# EAGLE design Shruti pothole (EAGLE 7.6.0)
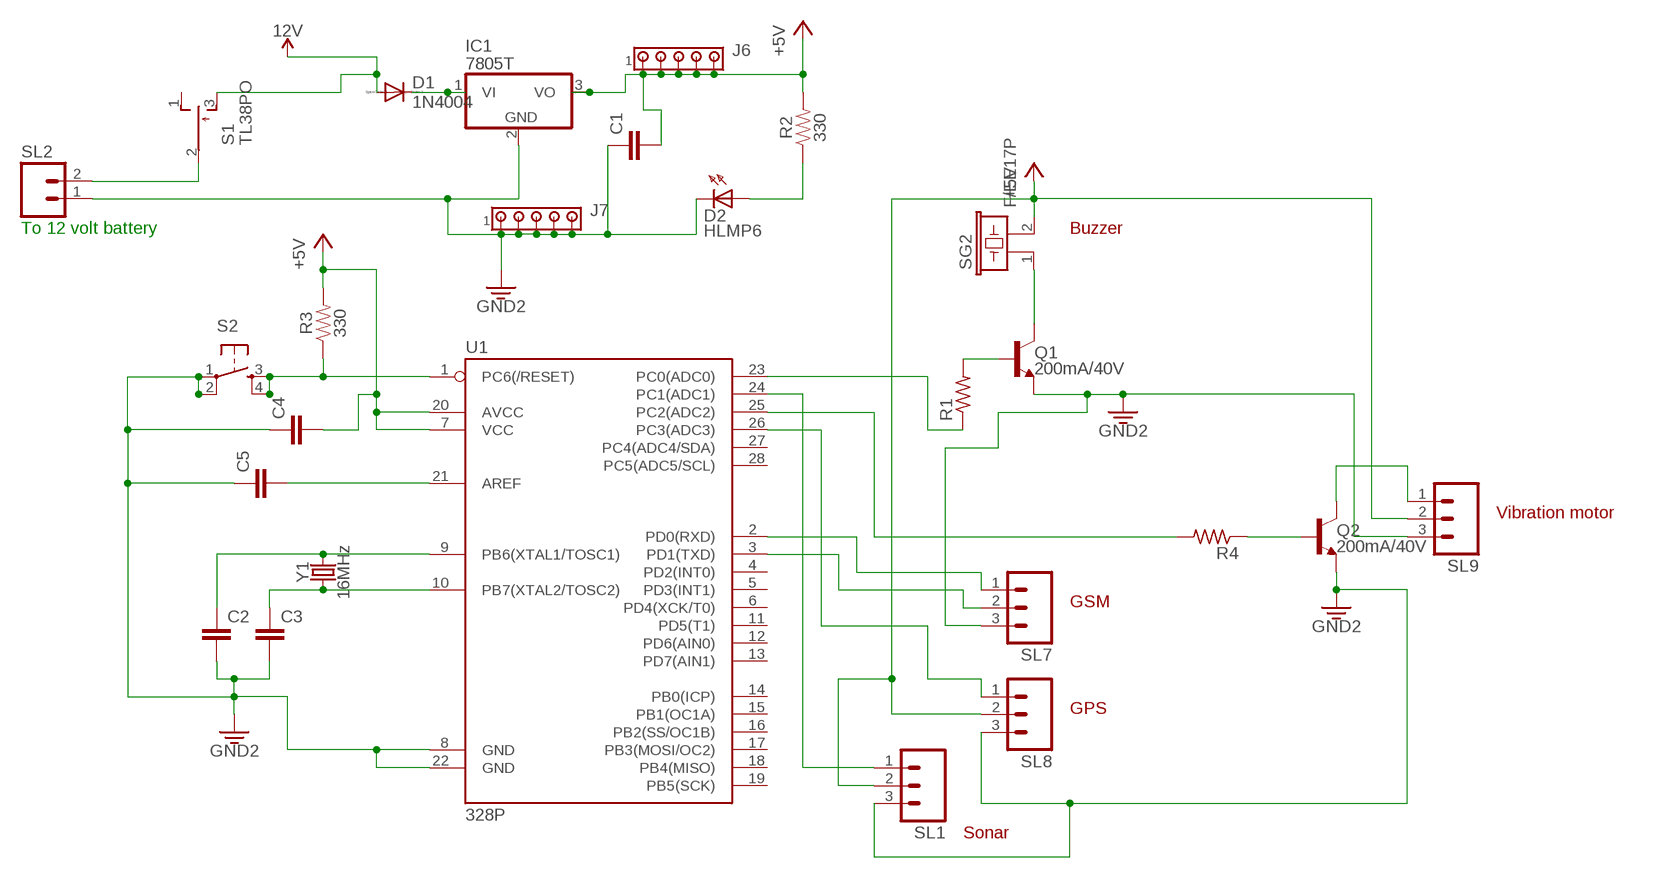
[diagram p0: schematic, sheet 1]

## Parts
C1  C5/2.5  [C5B2.5]
C2  C5/2.5  [C5B2.5]
C3  C5/2.5  [C5B2.5]
C4  C5/2.5  [C5B2.5]
C5  C5/2.5  [C5B2.5]
D1  1N4004  [DO41-10]
D2  HLMP6  [HLMP6]
IC1  7805T  [TO220H]
J6  MTA05-100  [10X05MTA]
J7  MTA05-100  [10X05MTA]
Q1  200mA/40V  TRANS_NPN-2N3904  [TO-92]
Q2  200mA/40V  TRANS_NPN-2N3904  [TO-92]
R1  R-US_0204/7  [0204/7]
R2  330  330OHM-HORIZ-1/10W-5%  [AXIAL-0.3]
R3  330  330OHM-HORIZ-1/10W-5%  [AXIAL-0.3]
R4  R-US_0204/7  [0204/7]
S1  TL38PO  [TL3XPO]
S2  TAC_SWITCHPTH  [TACTILE-PTH]
SG2  F/EE17P  [F/EE17P]
SL1  MA03  [03P]
SL2  MA02  [02PA]
SL7  MA03  [03P]
SL8  MA03  [03P]
SL9  MA03  [03P]
U1  328P  ATMEGA328P_PDIP  [DIP28]
Y1  16MHz  CRYSTAL-16MHZPTH-HC49US  [HC49US]

## Nets
3.3V: C1.1 C2.2 C3.2 C4.1 C5.1 D2.K IC1.2(GND) J7.1 J7.2 J7.3 J7.4 J7.5 Q1.1(E) Q2.1(E) S2.1 S2.2 SL1.3 SL2.1 SL7.3 SL8.3 SL9.3 U1.8(GND) U1.22(GND) ; supply symbol labelled GND2
12V: D1.A S1.3(S)
+5V: C1.2 C4.2 IC1.3(VO) J6.1 J6.2 J6.3 J6.4 J6.5 R2.P$2 R3.P$2 SG2.2 SL1.2 SL8.2 SL9.2 U1.7(VCC) U1.20(AVCC)
N$1: Q1.3(C) SG2.1
N$2: SL7.1 U1.2(PD0(RXD))
N$3: Q1.2(B) R1.2
N$4: Q2.2(B) R4.1
N$5: SL7.2 U1.3(PD1(TXD))
N$6: R1.1 U1.23(PC0(ADC0))
N$7: D2.A R2.P$1
N$8: C3.1 U1.10(PB7(XTAL2/TOSC2)) Y1.1
N$9: SL1.1 U1.24(PC1(ADC1))
N$10: R3.P$1 S2.3 S2.4 U1.1(PC6(/RESET))
N$11: R4.2 U1.25(PC2(ADC2))
N$12: C5.2 U1.21(AREF)
N$13: Q2.3(C) SL9.1
N$14: S1.2(P) SL2.2
N$15: SL8.1 U1.26(PC3(ADC3))
N$16: D1.C IC1.1(VI)
N$18: C2.1 U1.9(PB6(XTAL1/TOSC1)) Y1.2
Unconnected: S1.1(O) U1.4(PD2(INT0)) U1.5(PD3(INT1)) U1.6(PD4(XCK/T0)) U1.11(PD5(T1)) U1.12(PD6(AIN0)) U1.13(PD7(AIN1)) U1.14(PB0(ICP)) U1.15(PB1(OC1A)) U1.16(PB2(SS/OC1B)) U1.17(PB3(MOSI/OC2)) U1.18(PB4(MISO)) U1.19(PB5(SCK)) U1.27(PC4(ADC4/SDA)) U1.28(PC5(ADC5/SCL))

## Notes on the sheet
- To 12 volt battery | Buzzer
- Vibration motor
- GSM
- GPS
- Sonar

## Library data of the parts
C1-C5 = capacitor-wima:C: CAPACITOR naming: grid - package width
D1 = diode:1N4004: DIODE general purpose rectifier, 1 A
D2 = display-hp:HLMP6: LED 2mm horizontal; MF: AGILENT TECHNOLOGIES; MPN: HLMP-6500; OC_FARNELL: 1652490; OC_NEWARK: 40K0088
IC1 = linear:78*: Positive VOLTAGE REGULATOR Source: http://cache.national.com/ds/LM/LM78L05.pdf http://www.fairchildsemi.com/ds/LM/LM7805.pdf
J6 J7 = con-amp:MTA05-100: AMP connector
Q1 Q2 = SparkFun-DiscreteSemi:TRANS_NPN: NPN transistor Current controlled devices typically used to amplify current or used as a switch. BC547 - COM-08928 <http://www.sparkfun.com/products/8928> (TO-92 45V 100mA) (1.Collector 2.Base 3.Emitter) 2N3904 - COM-00521 <http://www.sparkfun.com/products/521> (TO-92 40V 200mA) (1.Emitter 2.Base 3.Collector) P2N2222A - COM-12852 <http://www.sparkfun.com/products/12852> (TO-92 40V 600mA) (1.Collector 2.Base 3.Emitter); PROD_ID: TRANS-08447
R1 R4 = resistor:R-US_: RESISTOR, American symbol
R2 R3 = SparkFun-Resistors:330OHM: 330Ω resistor A resistor is a passive two-terminal electrical component that implements electrical resistance as a circuit element. Resistors act to reduce current flow, and, at the same time, act to lower voltage levels within circuits. - Wikipedia; PROD_ID: RES-8371
S1 = switch:TL38PO: TINY SWITCH ON OFF MOM Source: http://www2.produktinfo.conrad.com/datenblaetter/700000-724999/705152-da-01-de-Subminiaturschalter_TL_36YO.pdf
S2 = SparkFun-Retired:TAC_SWITCH: Momentary Switch Button commonly used for reset or general input. Spark Fun Electronics SKU : COM-00097 SMT- SWCH-08247
SG2 = buzzer:F/EE17P: BUZZER Source: Buerklin; OC_FARNELL: unknown; OC_NEWARK: unknown
SL1 SL7-SL9 = con-amp-quick:MA03: AMP QUICK CONNECTOR; OC_FARNELL: unknown; OC_NEWARK: unknown
SL2 = con-amp-quick:MA02: AMP QUICK CONNECTOR; OC_FARNELL: unknown; OC_NEWARK: unknown
U1 = SparkFun-IC-Microcontroller:ATMEGA328P_PDIP: Atmel 328P Through hole ATMEGA328P uC used in the Arduino 32kb flash, 1k EEPROM, 2k SRAM Datasheet <http://www.sparkfun.com/datasheets/Components/SMD/ATMega328.pdf> SparkFun Products Storefront component: AVR 28 Pin 20MHz 32K 6A/D - ATMega328P <https://www.sparkfun.com/products/9061> (COM-09061) SparkFun Simon Says - Through-Hole Soldering Kit <https://www.sparkfun.com/products/10547> (KIT-10547) SparkFun Learn to Solder - Simon Says <https://www.sparkfun.com/products/13708> (KIT-13708) SparkFun BigTime Watch Kit <https://www.sparkfun.com/products/11734> (KIT-11734) SparkFun ClockIt <https://www.sparkfun.com/products/10930> (KIT-10930) SparkFun Serial Enabled LCD Kit <https://www.sparkfun.com/products/10097> (LCD-10097) SparkFun Simon Tilts - Through Hole Soldering Kit <https://www.sparkfun.com/products/12634> (KIT-12634) SparkFun Frequency Counter Kit <https://www.sparkfun.com/products/10140> (KIT-10140) FabFM Radio Kit <https://www.sparkfun.com/products/11043> (KIT-11043) SparkFun Binary Blaster Kit <https://www.sparkfun.com/products/12037> (KIT-12037) SparkFun Metro-Gnome <https://www.sparkfun.com/products/9236> (KIT-09236) ATmega328 with Arduino Optiboot (Uno) <https://www.sparkfun.com/products/10524> (DEV-10524); PROD_ID: IC-09136
Y1 = SparkFun-Clocks:CRYSTAL-16MHZ: 16MHz Crystal Digikey Example <http://www.digikey.com/product-search/en?keywords=535-9122-1-ND> Frequency: 16MHz Frequency Stability: ±50ppm Frequency Tolerance: ±20ppm Load Capacitance: 18pF SparkFun Products: Pro Micro -5V/16MHz <https://www.sparkfun.com/products/12640> SparkFun Serial Enabled LCD Kit <https://www.sparkfun.com/products/10097>; PROD_ID: XTAL-08181; SF_ID: COM-00536

## Board
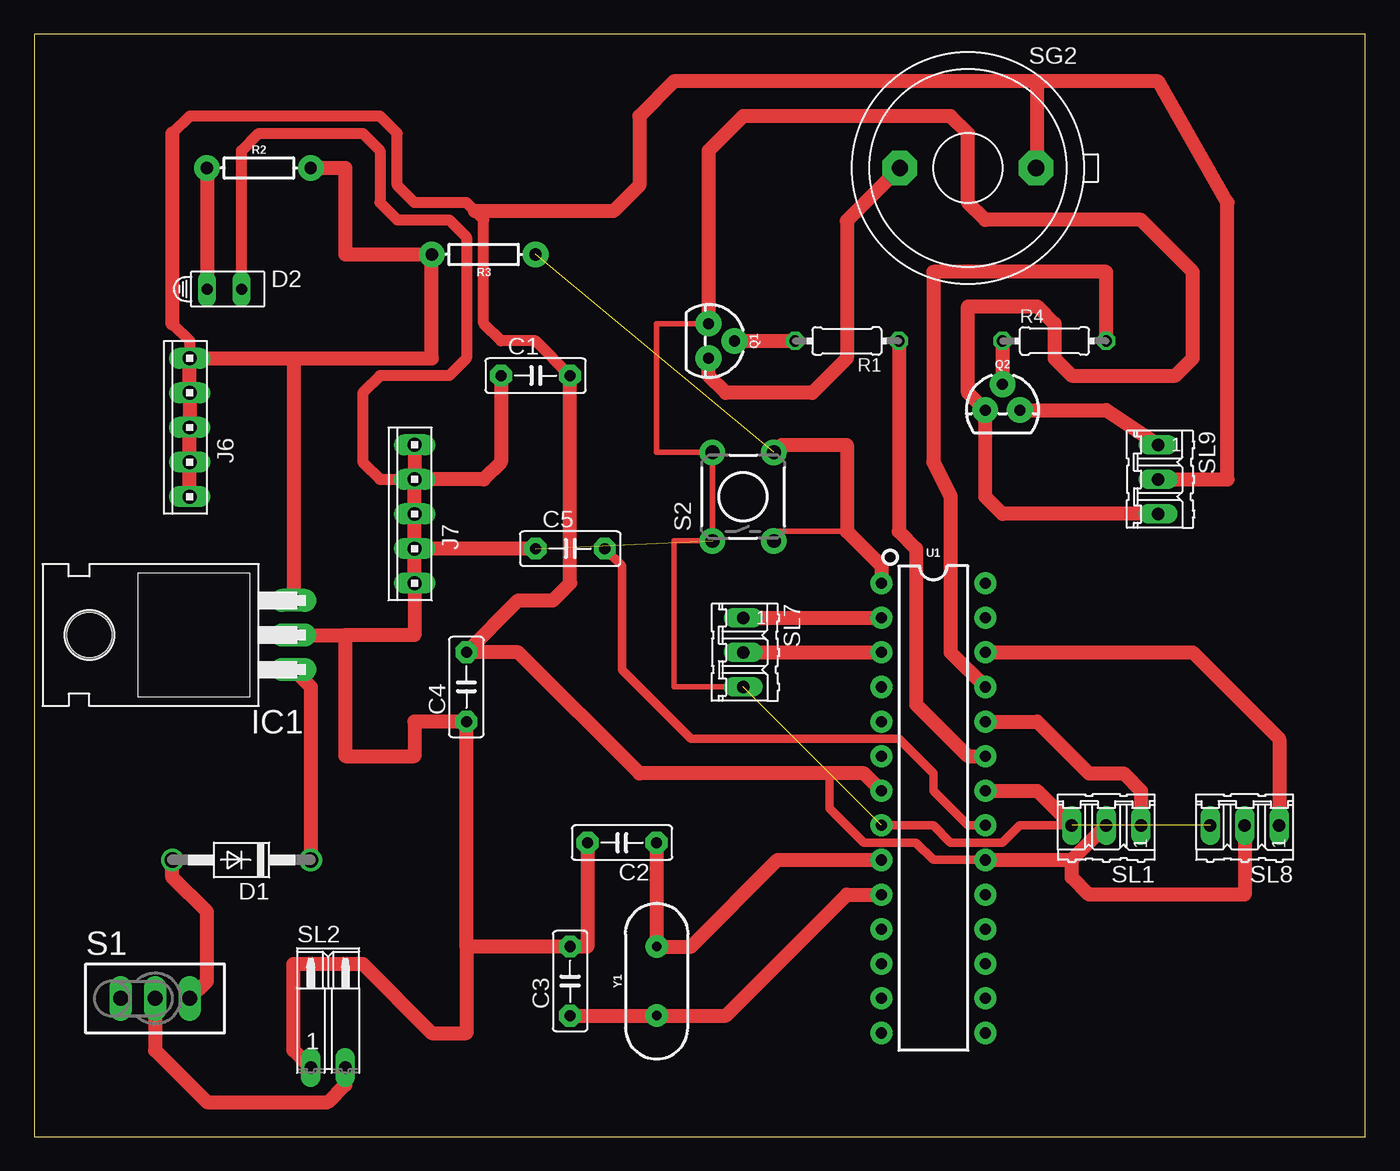
[diagram p1: board, top side]
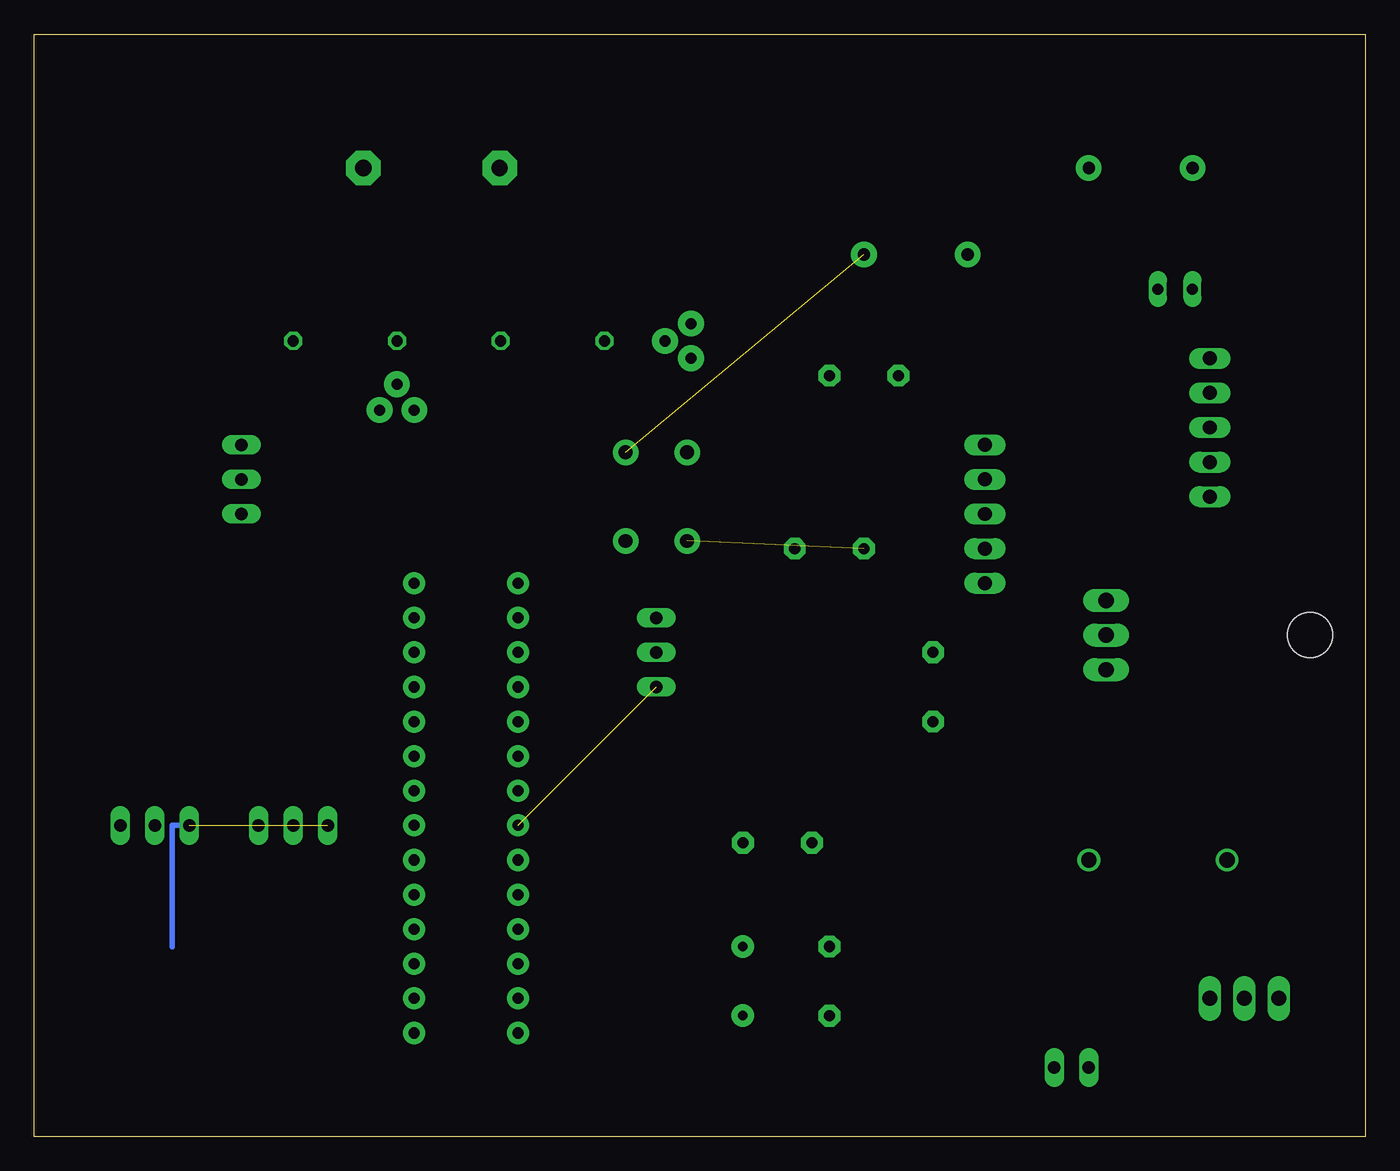
[diagram p2: board, bottom side, seen from below]

Size 97.77 x 80.95 mm. Coordinates in mm from the lower left corner, seen from the top.
Outline: 0,0 97.77,0 97.77,80.95 0,80.95 0,0
Copper layers (1*16): Top 0.035mm / dielectric 1.5mm / Bottom 0.035mm
Design rules "default": minimum track width 10mil, minimum drill 24mil, track to track 8mil, track to pad 8mil, pad to pad 8mil, via to via 8mil, smd to smd 8mil, copper to edge 40mil, drill to drill 8mil, minimum pad ring 10mil, minimum via ring 8mil, stop-mask expansion 4mil, vias tented up to drill 0mil, thermal gap 10mil

### Footprints (pad centres in the part's own frame; a part is rotated, then mirrored left to right if it is on the bottom)
C5B2.5 = drill 0.813 pad 1.6 octagon: 1 -2.54,0; 2 2.54,0
DO41-10 = drill 1.118: A 5.08,0; C -5.08,0
HLMP6 = drill 0.813 long: A -1.27,0; K 1.27,0
TO220H = drill 1.118 long: 1 -2.54,-10.16; 2 0,-10.16; 3 2.54,-10.16 | hole 3.302: 0,4.826
10X05MTA = drill 1.016 long: 1 5.08,0; 2 2.54,0; 3 0,0; 4 -2.54,0; 5 -5.08,0
TO-92 = drill 0.813 pad 1.88: 1 -1.27,0; 2 0,1.905; 3 1.27,0
0204/7 = drill 0.813 octagon: 1 -3.81,0; 2 3.81,0
AXIAL-0.3 = drill 0.9 pad 1.88: P$1 -3.81,0; P$2 3.81,0
TL3XPO = drill 1.1 pad 1.422 long: 1 -2.54,0; 2 0,0; 3 2.54,0
TACTILE-PTH = drill 1.016 pad 1.88: 1 -3.251,2.261; 2 3.251,2.261; 3 -3.251,-2.261; 4 3.251,-2.261
F/EE17P = drill 1.194 pad 2.54 octagon: 1 -5.004,0; 2 5.004,0
03P = drill 0.914 long: 1 -2.54,0; 2 0,0; 3 2.54,0
02PA = drill 0.914 long: 1 -1.27,0; 2 1.27,0
DIP28 = drill 0.813 pad 1.626: 1 -16.51,-3.81; 2 -13.97,-3.81; 3 -11.43,-3.81; 4 -8.89,-3.81; 5 -6.35,-3.81; 6 -3.81,-3.81; 7 -1.27,-3.81; 8 1.27,-3.81; 9 3.81,-3.81; 10 6.35,-3.81; 11 8.89,-3.81; 12 11.43,-3.81; 13 13.97,-3.81; 14 16.51,-3.81; 15 16.51,3.81; 16 13.97,3.81; 17 11.43,3.81; 18 8.89,3.81; 19 6.35,3.81; 20 3.81,3.81; 21 1.27,3.81; 22 -1.27,3.81; 23 -3.81,3.81; 24 -6.35,3.81; 25 -8.89,3.81; 26 -11.43,3.81; 27 -13.97,3.81; 28 -16.51,3.81
HC49US = drill 0.7 pad 1.651: 1 -2.54,0; 2 2.54,0

### Placement (x,y rotation side)
C1  36.83,55.88 0 top
C2  43.18,21.59 180 top
C3  39.37,11.43 90 top
C4  31.75,33.02 90 top
C5  39.37,43.18 0 top
D1  15.24,20.32 180 top
D2  13.97,62.23 0 top
IC1  8.89,36.83 90 top
J6  11.43,52.07 90 top
J7  27.94,45.72 90 top
Q1  49.53,58.42 270 top
Q2  71.12,53.34 0 top
R1  59.69,58.42 180 top
R2  16.51,71.12 0 top
R3  33.02,64.77 180 top
R4  74.93,58.42 0 top
S1  8.89,10.16 0 top
S2  52.07,46.99 90 top
SG2  68.58,71.12 0 top
SL1  78.74,22.86 180 top
SL2  21.59,5.08 0 top
SL7  52.07,35.56 270 top
SL8  88.9,22.86 180 top
SL9  82.55,48.26 270 top
U1  66.04,24.13 270 top
Y1  45.72,11.43 90 top

### Tracks (layer width: path | path; a pad name or v marks a point on that pad's centre or on a via)
3.3V  (3 unrouted)
  Top 0.406: SL7.3 46.99,33.02 46.99,43.74 S2.1 S2.2 45.72,50.24 45.72,59.69 Q1.1
  Top 0.61: U1.8 66.04,22.86 67.31,21.59 71.12,21.59 72.39,22.86 SL1.3
  Top 0.813: D2.K 15.24,72.39 16.51,73.66 24.13,73.66 25.4,72.39 25.4,68.58 26.67,67.31 30.48,67.31 31.75,66.04 31.75,57.15 30.48,55.88 25.4,55.88 24.13,54.61 24.13,49.53 25.4,48.26 J7.2
  Top 1.016: IC1.2 22.86,36.83 | 22.86,36.83 22.86,27.94 27.94,27.94 27.94,30.48 C4.1 31.75,13.97 | 31.75,13.97 C3.2 40.64,13.97 C2.2 | J7.2 J7.3 J7.4 | J7.4 J7.5 27.94,36.83 22.86,36.83 | C1.1 34.29,49.53 33.02,48.26 J7.2 | 31.75,13.97 31.75,7.62 29.21,7.62 24.13,12.7 19.05,12.7 19.05,6.35 SL2.1 | C5.1 J7.4 | U1.22 73.66,25.4 SL1.3 | J7.1 J7.2 | SL9.3 71.12,45.72 69.85,46.99 Q2.1 68.58,54.61 68.58,60.96 73.66,60.96 74.93,59.69 74.93,57.15 76.2,55.88 83.82,55.88 85.09,57.15 85.09,63.5 81.28,67.31 69.85,67.31 68.58,68.58 68.58,73.66 67.31,74.93 52.07,74.93 49.53,72.39 Q1.1
  Bottom 0.406: SL8.3 87.63,22.86 87.63,13.97
12V
  Top 1.016: S1.3 12.7,11.43 12.7,16.51 10.16,19.05 D1.A
+5V
  Top 0.61: U1.20 66.04,20.32 64.77,21.59 60.96,21.59 58.42,24.13 58.42,26.67
  Top 0.813: C1.2 36.83,58.42 34.29,58.42 33.02,59.69 33.02,67.31 32.38,67.95 31.75,68.58 27.94,68.58 26.67,69.85 26.67,73.66 25.4,74.93 11.43,74.93 10.16,73.66 | 10.16,59.69 11.43,58.42 J6.1
  Top 1.016: J6.5 J6.4 J6.3 J6.2 J6.1 19.05,57.15 | 19.05,57.15 IC1.3 | R2.P$2 22.86,71.12 22.86,64.77 R3.P$2 29.21,57.15 19.05,57.15 | U1.7 60.96,26.67 58.42,26.67 44.45,26.67 35.56,35.56 C4.2 35.56,39.37 38.1,39.37 39.37,40.64 C1.2 | 10.16,73.66 10.16,59.69 | U1.20 76.2,20.32 | 76.2,20.32 SL1.2 | SL8.2 88.9,17.78 77.47,17.78 76.2,19.05 76.2,20.32 | SL9.2 87.63,48.26 87.63,68.58 82.55,77.47 73.66,77.47 | 73.66,77.47 46.99,77.47 44.45,74.93 44.45,69.85 42.55,67.95 38.73,67.95 38.1,67.95 32.38,67.95 | SG2.2 73.66,71.2 73.66,77.47
N$1
  Top 1.016: SG2.1 59.69,67.23 59.69,57.15 57.15,54.61 50.8,54.61 49.53,55.88 Q1.3
N$2
  Top 1.016: SL7.1 U1.2
N$3
  Top 1.016: Q1.2 R1.2
N$4
  Top 1.016: R4.1 Q2.2
N$5
  Top 1.016: SL7.2 U1.3
N$6
  Top 1.016: R1.1 63.5,44.45 64.77,43.18 64.77,31.75 68.58,27.94 U1.23
N$7
  Top 1.016: R2.P$1 D2.A
N$8
  Top 1.016: C3.1 Y1.1 50.8,8.89 59.69,17.78 U1.10
N$9
  Top 1.016: U1.24 73.66,30.48 77.47,26.67 80.01,26.67 81.28,25.4 SL1.1
N$10  (1 unrouted)
  Top 0.406: 59.69,44.45 54.33,44.45 S2.3
  Top 1.016: S2.4 54.89,50.8 59.69,50.8 59.69,44.45 62.23,41.91 U1.1
N$11
  Top 1.016: R4.2 78.74,63.5 66.04,63.5 66.04,49.53 67.31,46.99 67.31,35.56 U1.25
N$12
  Top 0.61: C5.2 43.18,41.91 43.18,34.29 48.26,29.21 63.5,29.21 66.04,26.67 66.04,25.4 68.58,22.86 U1.21
N$13
  Top 1.016: Q2.3 78.74,53.34 SL9.1
N$14
  Top 1.016: S1.2 8.89,6.35 12.7,2.54 21.59,2.54 22.86,3.81 SL2.2
N$15
  Top 1.016: U1.26 85.09,35.56 91.44,29.21 SL8.1
N$16
  Top 1.016: IC1.1 20.32,33.02 D1.C
N$18
  Top 1.016: C2.1 Y1.2 48.26,13.97 54.61,20.32 U1.9